# Altium schematic sheet 08_GBIT_ETHERNET.SchDoc: Gigabit Ethernet
size 420 x 297 mm; Author: T. Ludemann; SheetNumber: 8; SheetTotal: 8; DocSize: DINA3
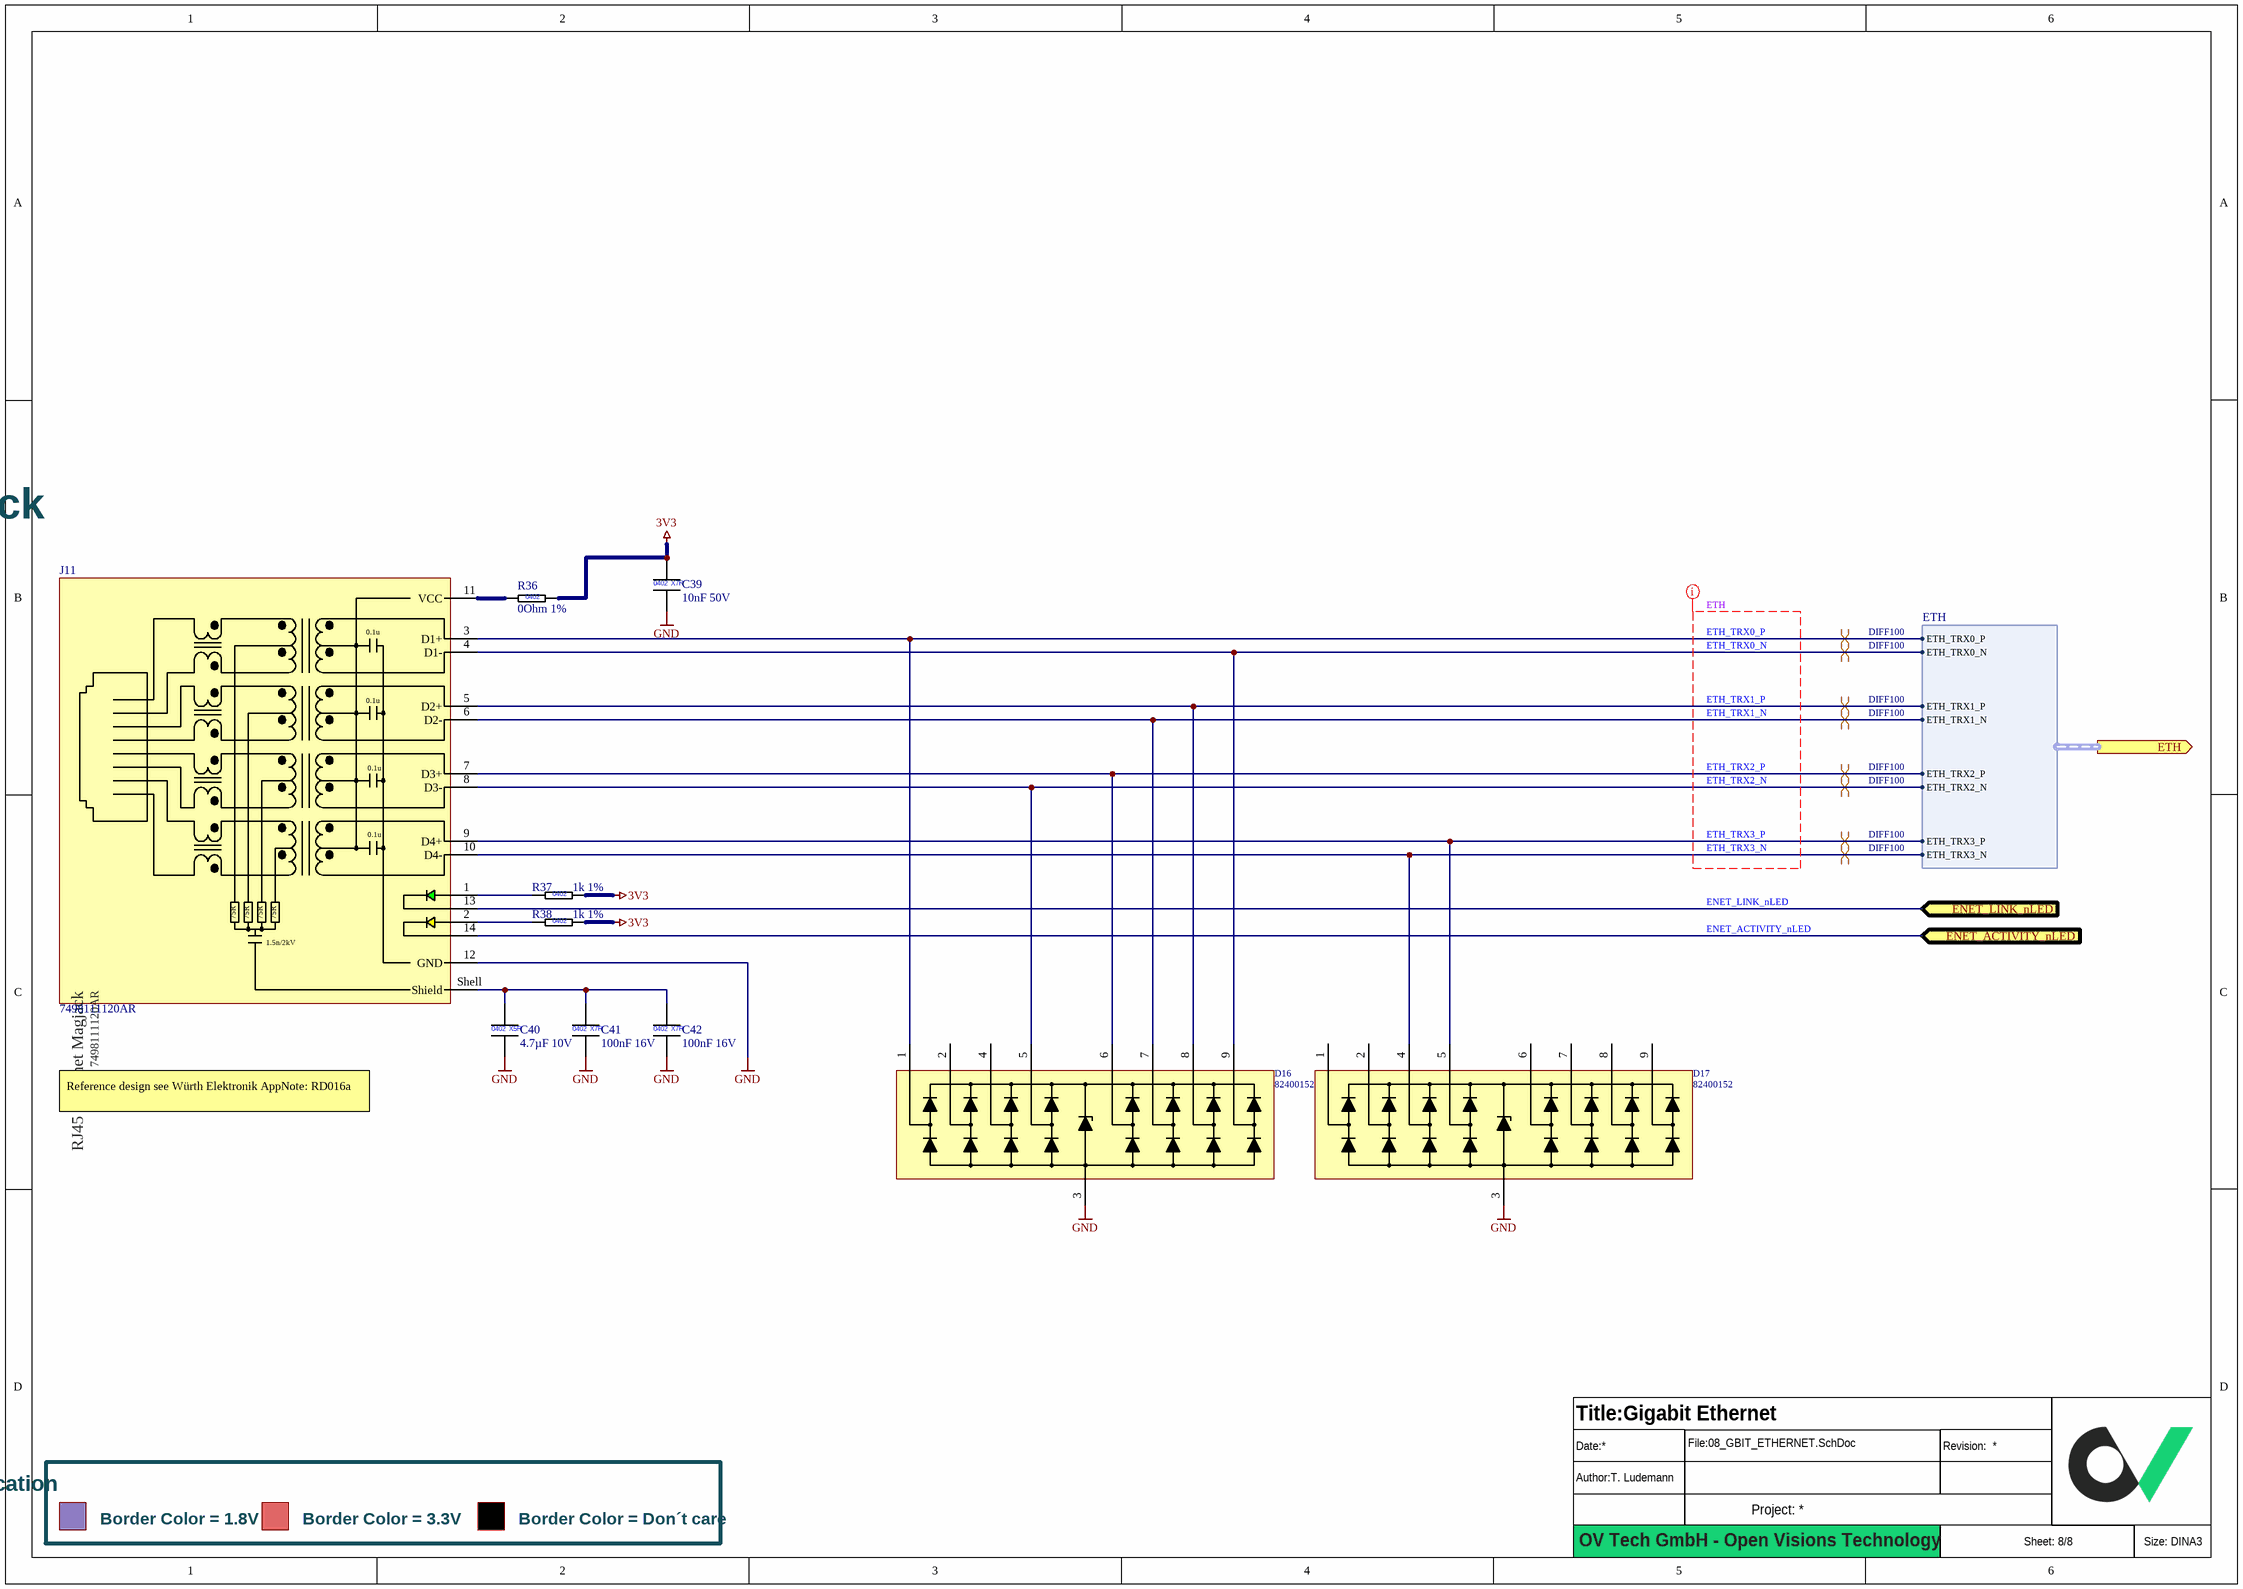
[diagram p0: 08_GBIT_ETHERNET.SchDoc]

## Parts
?  (no value)  (graphical)
C39  10nF 50V  [CAPC1005X06L]
C40  4.7µF 10V  [CAPC1005X06L]
C41  100nF 16V  [CAPC1005X06L]
C42  100nF 16V  [CAPC1005X06L]
D16  82400152  [WE-TVS_DFN3810-9L]
D17  82400152  [WE-TVS_DFN3810-9L]
J11  7498111120AR  [ETH-RJ45-7498111120AR]
R36  0Ohm 1%  [RESC1005X04L]
R37  1k 1%  [RESC1005X04L]
R38  1k 1%  [RESC1005X04L]

## Ports
ENET_ACTIVITY_nLED (in), ENET_LINK_nLED (in), ETH (out, harness ETH)

## Harnesses
ETH: ETH_TRX0_P, ETH_TRX0_N, ETH_TRX1_N, ETH_TRX1_P, ETH_TRX2_P, ETH_TRX2_N, ETH_TRX3_P, ETH_TRX3_N

## Nets
3V3: C39.1 R36.2 R37.2 R38.2
GND: C39.2 C40.2 C41.2 C42.2 D16.3(GND) D17.3(GND) J11.12(GND)
ENET_ACTIVITY_nLED: J11.14 ; port ENET_ACTIVITY_nLED
ENET_LINK_nLED: J11.13 ; port ENET_LINK_nLED
ETH_TRX0_N: D16.9(I/O_9) J11.4(D1-) ; port ETH.ETH_TRX0_N
ETH_TRX0_P: D16.1(I/O_1) J11.3(D1+) ; port ETH.ETH_TRX0_P
ETH_TRX1_N: D16.7(I/O_7) J11.6(D2-) ; port ETH.ETH_TRX1_N
ETH_TRX1_P: D16.8(I/O_8) J11.5(D2+) ; port ETH.ETH_TRX1_P
ETH_TRX2_N: D16.5(I/O_5) J11.8(D3-) ; port ETH.ETH_TRX2_N
ETH_TRX2_P: D16.6(I/O_6) J11.7(D3+) ; port ETH.ETH_TRX2_P
ETH_TRX3_N: D17.4(I/O_4) J11.10(D4-) ; port ETH.ETH_TRX3_N
ETH_TRX3_P: D17.5(I/O_5) J11.9(D4+) ; port ETH.ETH_TRX3_P
NetC40_1: C40.1 C41.1 C42.1 J11.Shell(Shield)
NetJ11_1: J11.1 R37.1
NetJ11_2: J11.2 R38.1
NetJ11_11: J11.11(VCC) R36.1

Not connected (* = marked no-connect by the designer): D16 2(I/O_2) 4(I/O_4); D17 1(I/O_1) 2(I/O_2) 6(I/O_6) 7(I/O_7) 8(I/O_8) 9(I/O_9)

## Layout directives
net class ETH: ETH_TRX0_N, ETH_TRX0_P, ETH_TRX1_N, ETH_TRX1_P, ETH_TRX2_N, ETH_TRX2_P, ETH_TRX3_N, ETH_TRX3_P
differential pair; differential pair class DIFF100: ETH_TRX0_N, ETH_TRX0_P, ETH_TRX1_N, ETH_TRX1_P, ETH_TRX2_N, ETH_TRX2_P, ETH_TRX3_N, ETH_TRX3_P

## Notes on the sheet
- Gbit Ethernet MagJack
- Reference design see Würth Elektronik AppNote: RD016a
- Signal Level Indication
- Border Color = 1.8V
- Border Color = 3.3V
- Border Color = Don´t care
- OV Tech GmbH - Open Visions Technology
- (in symbol CAP_0402_4.7µ_10V) 0402; X5R
- (in symbol CAP_0402_10nF_50V) 0402; X7R
- (in symbol CAP_0402_100nF_16V) 0402; X7R
- (in symbol ETH-RJ45_7498111120AR) 0.1u; 75R; 1.5n/2kV; RJ45 Ethernet Magjack
- (in symbol RES_0402_0R_1%) 0402
- (in symbol RES_0402_1k_1%) 0402

## Library data of the parts
? = Titleblock_01_OpenSource
C39 = CAP_0402_10nF_50V: Multilayer Ceramic Capacitors MLCC - SMD/SMT 0402 50VDC; Manufacturer 1: Murata Electronics; Manufacturer 1 Prt. Nr.: GCM155R71H103KA55J; Manufacturer 2 Prt. Nr.: C0402C103K5RAC7411; Manufacturer 2: KEMET
C40 = CAP_0402_4.7µ_10V: Multilayer Ceramic Capacitors MLCC - SMD/SMT 0402 10VDC; Manufacturer 1: Murata Electronics; Manufacturer 1 Prt. Nr.: GRM155R61A475MEAAD; Manufacturer 2 Prt. Nr.: MSASL105BB5475MFNB33; Manufacturer 2: Taiyo Yuden
C41 C42 = CAP_0402_100nF_16V: Multilayer Ceramic Capacitors MLCC - SMD/SMT 0402 16VDC; Manufacturer 1: KYOCERA AVX; Manufacturer 1 Prt. Nr.: KGM05AR71C104KH; Manufacturer 2 Prt. Nr.: EMK105B7104KV-F; Manufacturer 2: Taiyo Yuden
D16 D17 = ESD 5.5V_824014885: WE-TVS TVS Diode – Super Speed Series; Manufacturer 1: Würth Elektronik; Manufacturer 1 Prt. Nr.: 824014885
J11 = ETH-RJ45_7498111120AR: Rj45 Conn, Jack, 8P8C, 1Port, Smt; Manufacturer 1: Würth Elektronik; Manufacturer 1 Prt. Nr.: 7498111120AR
R36 = RES_0402_0R_1%: Thick Film Resistors - SMD 0OHM 1%; Manufacturer 1: Bourns; Manufacturer 1 Prt. Nr.: CR0402AJ/-000GAS; Manufacturer 2 Prt. Nr.: AC0402FR-070RL; Manufacturer 2: YAGEO
R37 R38 = RES_0402_1k_1%: Thick Film Resistors - SMD 1k 1%; Manufacturer 1: Vishay / Dale; Manufacturer 1 Prt. Nr.: CRCW04021K00FKEDC; Manufacturer 2 Prt. Nr.: RT0402FRE131KL; Manufacturer 2: YAGEO